# Altium schematic sheet betaV1.1.SchDoc
size A2
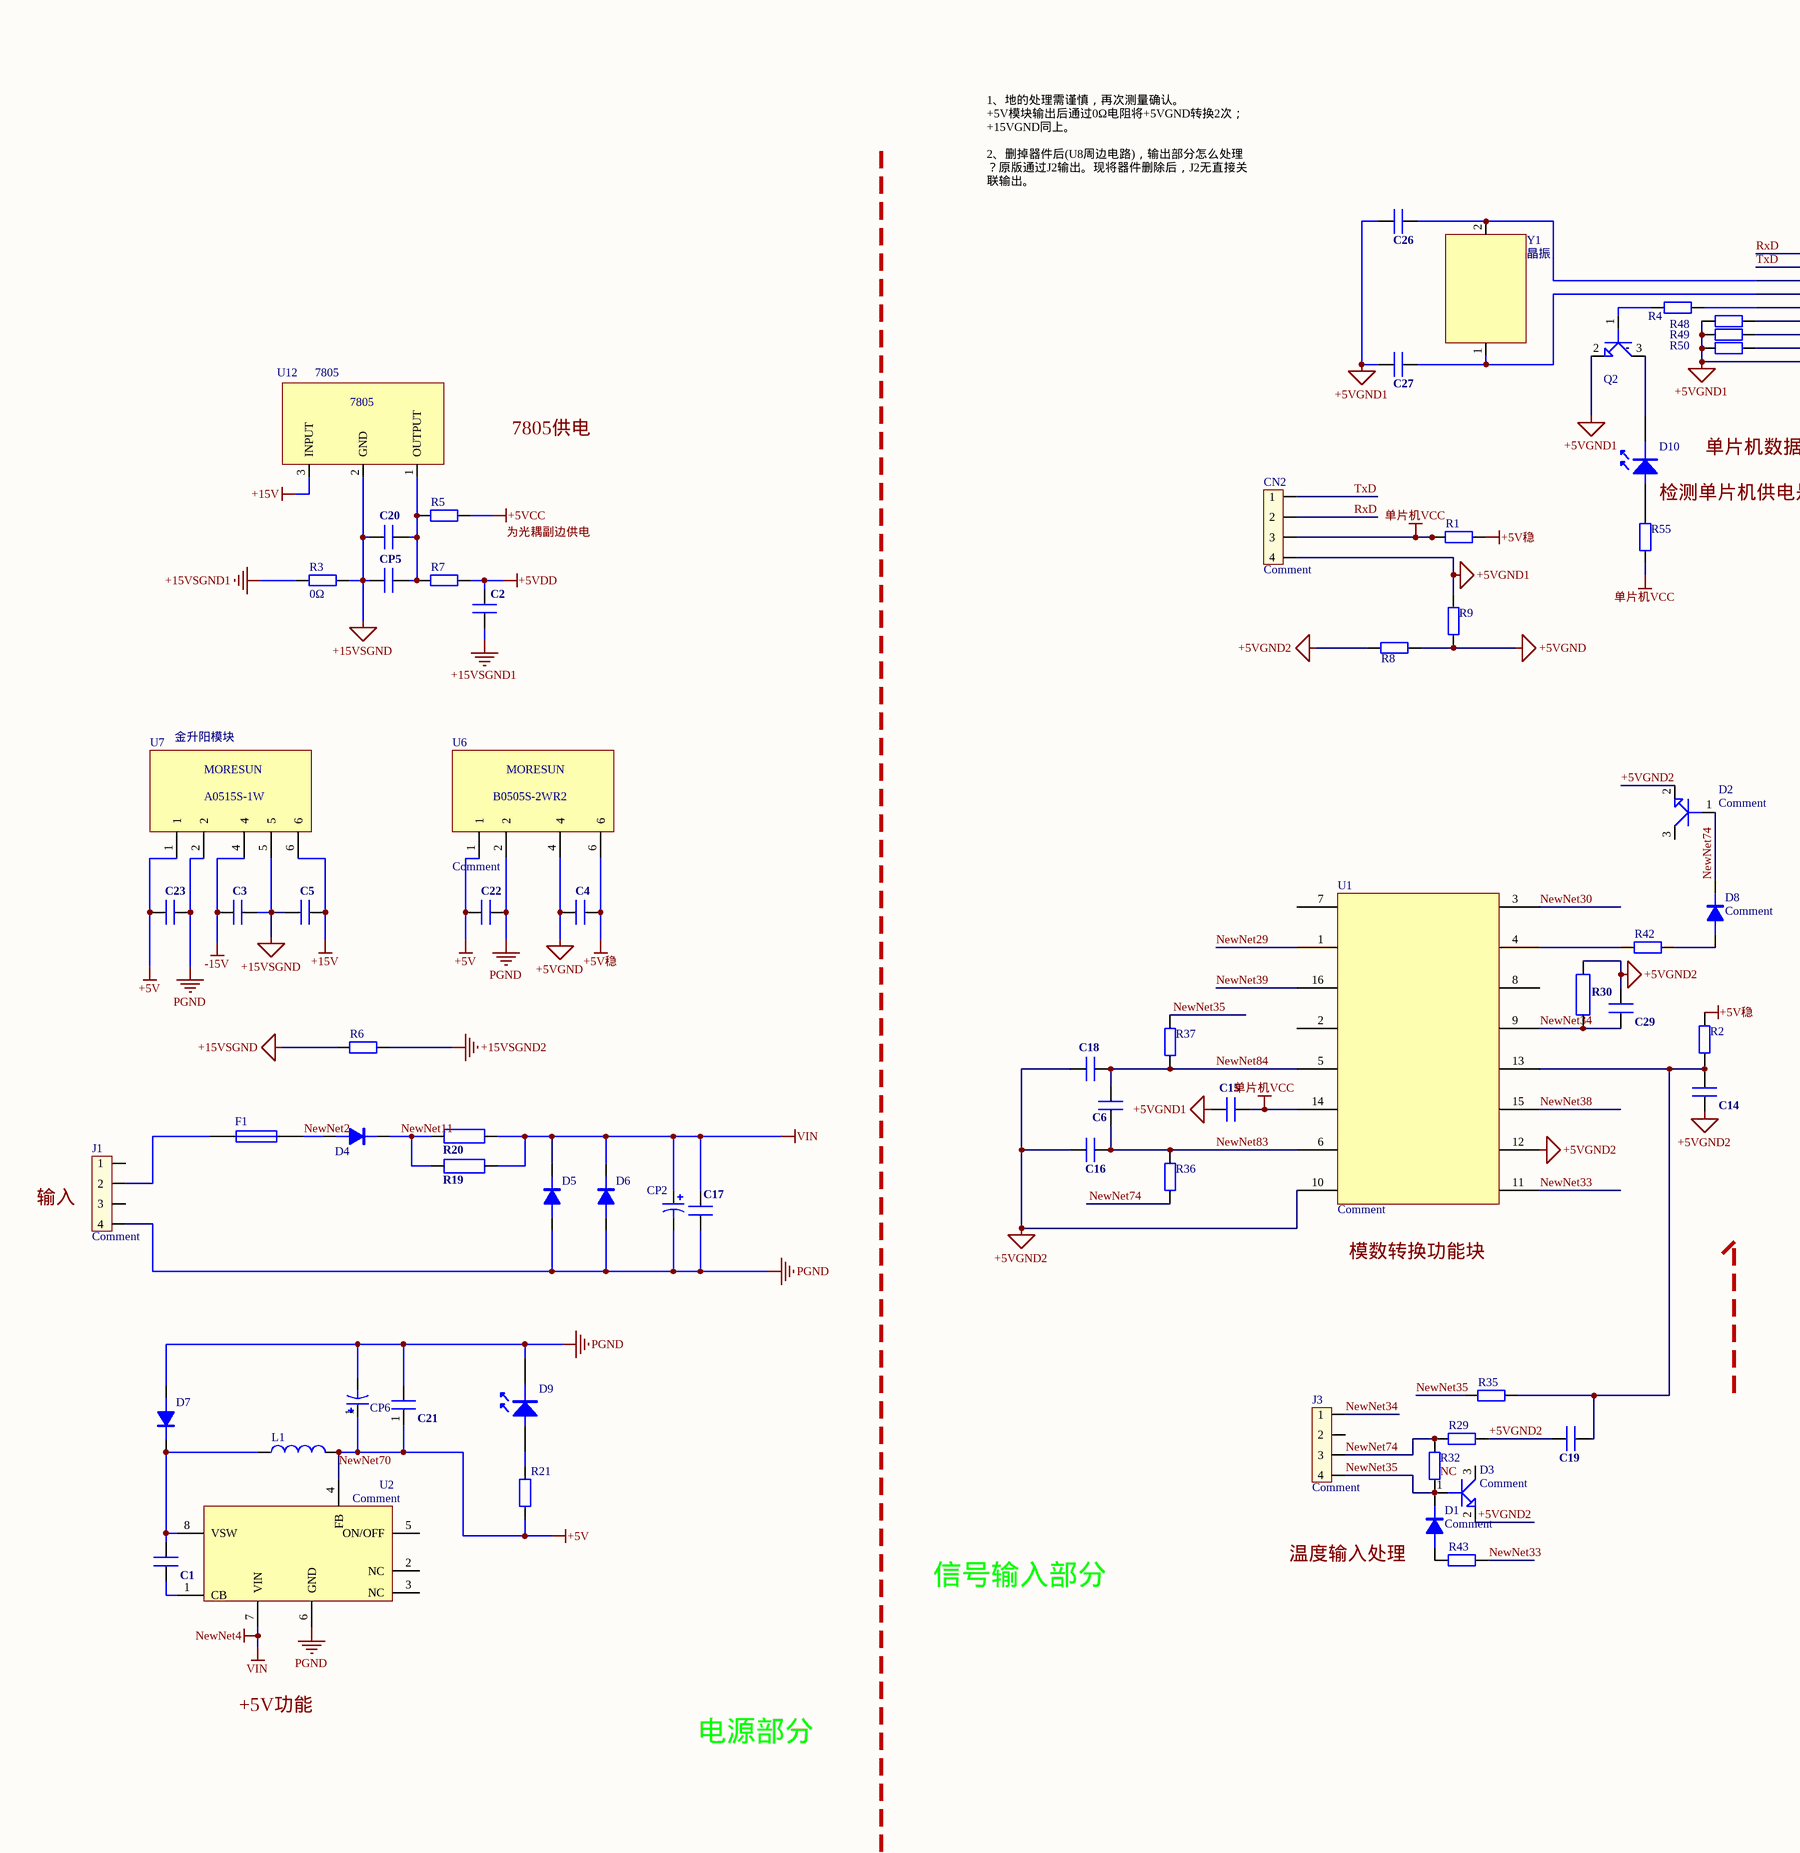
[diagram p0: betaV1.1.SchDoc, left]
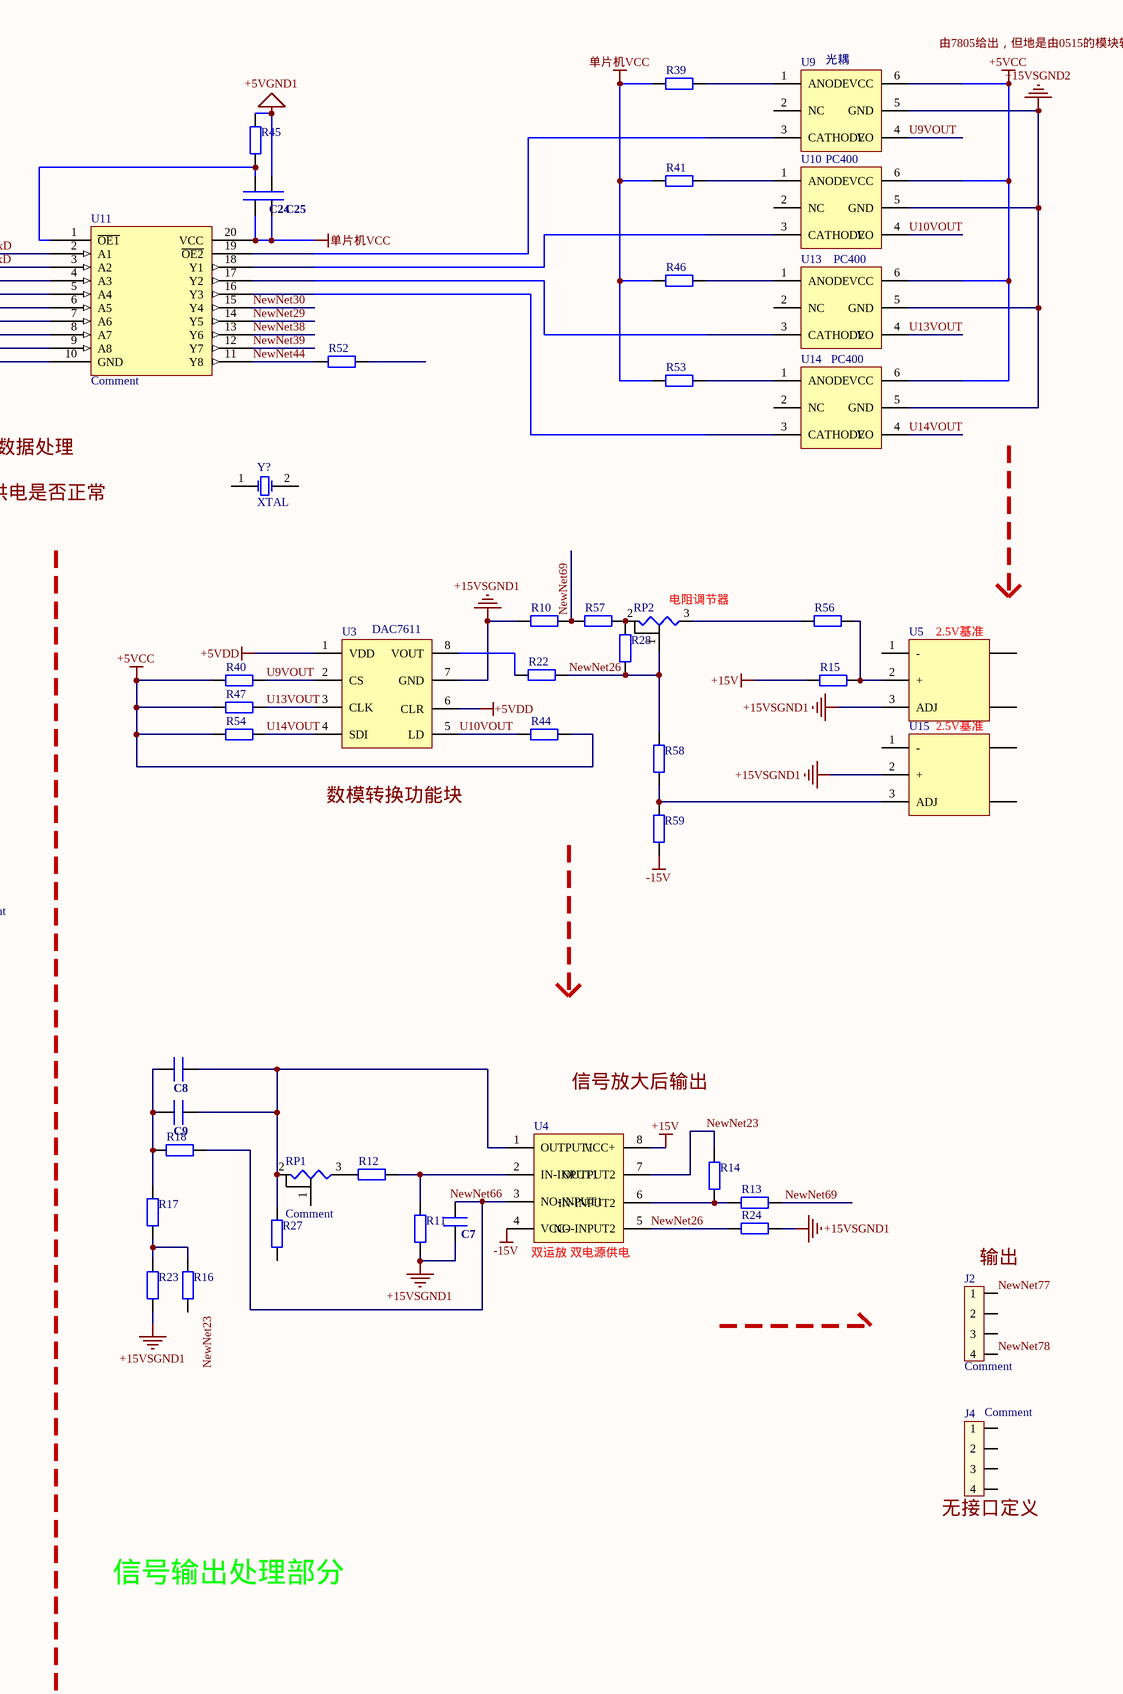
[diagram p1: betaV1.1.SchDoc, right]

## Parts
C1  Comment  [C0805]  (value not drawn)
C2  Comment  [C0805]  (value not drawn)
C3  Comment  [C0805]  (value not drawn)
C4  Comment  [C0805]  (value not drawn)
C5  Comment  [C0805]  (value not drawn)
C6  Comment  [C0805]  (value not drawn)
C7  Comment  [C0805]  (value not drawn)
C8  Comment  [C0805]  (value not drawn)
C9  Comment  [C0805]  (value not drawn)
C14  Comment  [C0805]  (value not drawn)
C15  Comment  [C0805]  (value not drawn)
C16  Comment  [C0805]  (value not drawn)
C17  Comment  [C0805]  (value not drawn)
C18  Comment  [C0805]  (value not drawn)
C19  Comment  [C0805]  (value not drawn)
C20  Comment  [C0805]  (value not drawn)
C21  Comment  [C0805]  (value not drawn)
C22  Comment  [C0805]  (value not drawn)
C23  Comment  [C0805]  (value not drawn)
C24  Comment  [C0805]  (value not drawn)
C25  Comment  [C0805]  (value not drawn)
C26  Comment  [C0805]  (value not drawn)
C27  Comment  [C0805]  (value not drawn)
C29  Comment  [C0805]  (value not drawn)
CN2  Comment  [HDR2.54-LI-4P]
CP2  Comment  [CAP 3.5*8*11.5]  (value not drawn)
CP5  Comment  [CD B(3528)]  (value not drawn)
CP6  Comment  [CAP 3.5*8*11.5]  (value not drawn)
D1  Comment  [SOD-123]
D2  Comment  [SOT-23]
D3  Comment  [SOT-23]
D4  Comment  [SS14]  (value not drawn)
D5  Comment  [SMB]  (value not drawn)
D6  Comment  [SMB]  (value not drawn)
D7  (no value)  [SS14]
D8  Comment  [SOD-123]
D9  (no value)  [LED 3MM-R]
D10  (no value)  [LED 3MM-R]
F1  Comment  [FU 1812]  (value not drawn)
J1  Comment  [电源输入/出]
J2  Comment  [电源输入/出]
J3  Comment  [电源输入/出]
J4  Comment  [电源输入/出]
L1  Comment  [PK0810]  (value not drawn)
Q2  Comment  [SOT-23]  (value not drawn)
R1  Comment  [R0805]  (value not drawn)
R2  Comment  [R0805]  (value not drawn)
R3  value 0Ω  [R0805]  (hidden comment: Comment)
R4  Comment  [R0805]  (value not drawn)
R5  Comment  [R0805]  (value not drawn)
R6  Comment  [R0805]  (value not drawn)
R7  Comment  [R0805]  (value not drawn)
R8  Comment  [R0805]  (value not drawn)
R9  Comment  [R0805]  (value not drawn)
R10  Comment  [R0805]  (value not drawn)
R11  Comment  [R0805]  (value not drawn)
R12  Comment  [R0805]  (value not drawn)
R13  Comment  [R0805]  (value not drawn)
R14  Comment  [R0805]  (value not drawn)
R15  Comment  [R0805]  (value not drawn)
R16  Comment  [R0805]  (value not drawn)
R17  Comment  [R0805]  (value not drawn)
R18  Comment  [R0805]  (value not drawn)
R19  Comment  [金属膜电阻-RS 1/2W-V4]  (value not drawn)
R20  Comment  [金属膜电阻-RS 1/2W-V4]  (value not drawn)
R21  Comment  [R0805]  (value not drawn)
R22  Comment  [R0805]  (value not drawn)
R23  Comment  [R0805]  (value not drawn)
R24  Comment  [R0805]  (value not drawn)
R27  Comment  [R0805]  (value not drawn)
R28  Comment  [R0805]  (value not drawn)
R29  Comment  [R0805]  (value not drawn)
R30  Comment  [金属膜电阻-RS 1/2W-V4]  (value not drawn)
R32  value NC  [R0805]  (hidden comment: Comment)
R35  Comment  [R0805]  (value not drawn)
R36  Comment  [R0805]  (value not drawn)
R37  Comment  [R0805]  (value not drawn)
R39  Comment  [R0805]  (value not drawn)
R40  Comment  [R0805]  (value not drawn)
R41  Comment  [R0805]  (value not drawn)
R42  10k  [R0805]  (value not drawn)
R43  Comment  [R0805]  (value not drawn)
R44  Comment  [R0805]  (value not drawn)
R45  Comment  [R0805]  (value not drawn)
R46  Comment  [R0805]  (value not drawn)
R47  Comment  [R0805]  (value not drawn)
R48  Comment  [R0805]  (value not drawn)
R49  Comment  [R0805]  (value not drawn)
R50  Comment  [R0805]  (value not drawn)
R52  Comment  [R0805]  (value not drawn)
R53  Comment  [R0805]  (value not drawn)
R54  Comment  [R0805]  (value not drawn)
R55  Comment  [R0805]  (value not drawn)
R56  Comment  [R0805]  (value not drawn)
R57  Comment  [R0805]  (value not drawn)
R58  Comment  [R0805]  (value not drawn)
R59  Comment  [R0805]  (value not drawn)
RP1  Comment  [可调电阻]
RP2  电阻调节器  [可调电阻]
U1  Comment  [TSSOP16]
U2  Comment  [SO-8]
U3  DAC7611  [SO-8]
U4  双运放 双电源供电  [SO-8]
U5  value 2.5V基准  [LM336]
U6  Comment  [B0505S-2WR2]
U7  金升阳模块  [B0505S-2WR2]
U9  光耦  [PC400]
U10  PC400  [PC400]
U11  Comment  [12C5616AD-SOP20]
U12  7805
U13  PC400  [PC400]
U14  PC400  [PC400]
U15  value 2.5V基准  [LM336]
Y1  晶振  [晶振]
Y?  XTAL  [R38]

## Nets
+5VCC: R5.2 R40.2 R44.2 R47.2 R54.2 U9.6(VCC) U10.6(VCC) U13.6(VCC) U14.6(VCC)
+5VDD: C2.1 R7.1 U3.1(VDD) U3.6(CLR)
+5VGND: C4.2 R8.1 R9.1 U6.4
+5VGND1: C15.1 C25.2 C26.2 C27.1 CN2.4 Q2.2(E) R9.2 R45.2 R48.2 R49.2 R50.2 U11.10(GND)
+5VGND2: C14.1 C16.2 C18.1 C19.2 C29.2 D2.2(E) D3.2(E) R8.2 R29.1 R30.2 U1.10(PGND) U1.12(SS)
+5V稳: C4.1 R1.1 R2.2 U6.6
+15V: C5.1 R15.1 U4.8(VCC+) U7.6 U12.3(INPUT)
+15VSGND: C3.1 C5.2 C20.1 CP5.1 R3.2 R6.2 U7.5 U12.2(GND)
+15VSGND1: C2.2 C7.1 R3.1 R10.1 R11.1 R23.1 R24.2 U3.7(GND) U5.3(ADJ) U15.2(+)
+15VSGND2: R6.1 U9.5(GND) U10.5(GND) U13.5(GND) U14.5(GND)
-15V: C3.2 R59.2 U4.4(VCC-) U7.4
NewNet4: C17.1 CP2.1 D5.2(K) D6.2(K) R19.2 R20.2 U2.7(VIN)  [also labelled VIN]
NewNet70: C21.1 C22.2 C23.2 CP6.1 L1.2 R21.2 U2.4(FB) U6.1 U7.1  [also labelled +5V]
PGND: C17.2 C21.2 C22.1 C23.1 CP2.2 CP6.2 D5.1(A) D6.1(A) D7.2(K) D9.2 J1.4 U2.6(GND) U6.2 U7.2
单片机VCC: C15.2 C24.2 C25.1 CN2.3 R1.2 R39.1 R41.1 R46.1 R53.1 R55.1 U1.14(RT) U11.20(VCC)
NewNet2: D4.1(A) F1.2
NewNet11: D4.2(K) R19.1 R20.1
NewNet23: R14.1 U4.7(OUTPUT2)
NewNet26: R22.1 R24.1 R28.2 R58.2 RP2.1 U4.5(NO-INPUT2)
NewNet29: U1.1(VIN) U11.14(Y5)
NewNet30: U1.3(CS1) U11.15(Y4)
NewNet33: R43.1 U1.11(ANGD)
NewNet34: C29.1 J3.1 R30.1 U1.9(OUTB)
NewNet35: D1.2(K) D3.1(B) J3.4 R32.2 R35.1 R37.2
NewNet38: U1.15(SYNC) U11.13(Y6)
NewNet39: U1.16(UVLO) U11.12(Y7)
NewNet44: R52.2 U11.11(Y8)
NewNet69: R10.2 R13.2 R57.2
NewNet74: D2.1(B) D8.2(K) J3.3 R29.2 R32.1 R36.2
NewNet77: J2.1
NewNet78: J2.4
NewNet83: C6.2 C16.1 R36.1 U1.6(REF)
NewNet84: C6.1 C18.2 R37.1 U1.5(TIME)
RxD: CN2.2 U11.2(A1)
TxD: CN2.1 U11.3(A2)
U9VOUT: R40.1 U3.2(CS) U9.4(VO)
U10VOUT: R44.1 U3.5(LD) U10.4(VO)
U13VOUT: R47.1 U3.3(CLK) U13.4(VO)
U14VOUT: R54.1 U3.4(SDI) U14.4(VO)
NetC1_1: C1.1 U2.1(CB)
NetC1_2: C1.2 D7.1(A) L1.1 U2.8(VSW)
NetC7_2: C7.2 R18.2 U4.3(NO-INPUT1)
NetC8_1: C8.1 C9.1 R17.2 R18.1
NetC8_2: C8.2 C9.2 R27.1 RP1.2 U4.1(OUTPUT1)
NetC14_2: C14.2 C19.1 R2.1 R35.2 U1.13(COMP)
NetC20_2: C20.2 CP5.2 R5.1 R7.2 U12.1(OUTPUT)
NetC24_1: C24.1 R45.1 U11.1(~{OE1})
NetC26_1: C26.1 U11.4(A3) Y1.2(GND)
NetC27_2: C27.2 U11.5(A4) Y1.1(CONTRL)
NetD1_1: D1.1(A) R43.2
NetD8_1: D8.1(A) R42.2
NetD9_1: D9.1 R21.1
NetD10_1: D10.1 R55.2
NetD10_2: D10.2 Q2.3(C)
NetF1_1: F1.1 J1.2
NetQ2_1: Q2.1(B) R4.2
NetR4_1: R4.1 U11.6(A5)
NetR11_2: R11.2 R12.2 U4.2(IN-INPUT1)
NetR12_1: R12.1 RP1.3
NetR13_1: R13.1 R14.2 U4.6(IN-INPUT2)
NetR15_2: R15.2 R56.1 U5.2(+)
NetR16_2: R16.2 R17.1 R23.2
NetR22_2: R22.2 U3.8(VOUT)
NetR28_1: R28.1 R57.1 RP2.2
NetR39_2: R39.2 U9.1(ANODE)
NetR41_2: R41.2 U10.1(ANODE)
NetR42_1: R42.1 U1.4(CS2)
NetR46_2: R46.2 U13.1(ANODE)
NetR48_1: R48.1 U11.7(A6)
NetR49_1: R49.1 U11.8(A7)
NetR50_1: R50.1 U11.9(A8)
NetR53_2: R53.2 U14.1(ANODE)
NetR56_2: R56.2 RP2.3
NetR58_1: R58.1 R59.1 U15.3(ADJ)
NetU9_3: U9.3(CATHODE) U11.19(~{OE2})
NetU10_3: U10.3(CATHODE) U11.18(Y1)
NetU11_16: U11.16(Y3) U14.3(CATHODE)
NetU11_17: U11.17(Y2) U13.3(CATHODE)

Not connected (* = marked no-connect by the designer): D2 3(C); D3 3(C); J1 1 3; J2 2 3; J3 2; J4 1 2 3 4; R16 1; R27 2; R52 1; RP1 1; U1 2(RAMP) 7(VCC) 8(OUTA); U2 2(NC) 3(NC) 5(ON/OFF); U5 1(-) 4 5; U9 2(NC); U10 2(NC); U13 2(NC); U14 2(NC); U15 1(-) 4 5; Y? 1(OSC1) 2(OSC2)

## Notes on the sheet
- 由7805给出，但地是由0515的模块转出？
- 1、地的处理需谨慎，再次测量确认。
  +5V模块输出后通过0Ω电阻将+5VGND转换2次；+15VGND同上。
  2、删掉器件后(U8周边电路)，输出部分怎么处理？原版通过J2输出。现将器件删除后，J2无直接关联输出。
- 7805供电
- 检测单片机供电是否正常
- 单片机数据处理
- 为光耦副边供电
- (near U3) 数模转换功能块
- 信号放大后输出
- 输入
- (near U1) 模数转换功能块
- (near J2) 输出
- (near J4) 无接口定义
- 信号输入部分
- 温度输入处理
- 信号输出处理部分
- +5V功能
- 电源部分
- Labels drawn without touching a wire or pin: NewNet23, NewNet66
- (in symbol A0515S-1W) MORESUN
- (in symbol B0505S2W) MORESUN; B0505S-2WR2

## Library data of the parts
C1 = 04-02-01: VALUE: 50V/103
C2-C9 C14-C16 C18-C20 C22-C27 C29 CP5 = 04-02-01: VALUE: 25V/105
C17 C21 = 04-02-01: VALUE: 50V/104
CN2 J1-J4 = CON4
CP2 CP6 = Cap Pol3: Value: 50V100UF
D1 D5-D8 = DIODE
D2 D3 Q2 = NPN-SOT23
D4 = DIODE: VALUE: 1A/40V
D9 D10 = LED
F1 = Fuse 1: VALUE: 1A/50V
L1 = Inductor: Value: 47uH
R1-R18 R21-R24 R27-R29 R32 R35-R37 R39-R50 R52-R59 = Res: Resistor; Published: 8-Jun-2000; LatestRevisionDate: 17-Jul-2002; LatestRevisionNote: Re-released for DXP Platform.; PackageReference: AXIAL-0.4; Publisher: Altium Limited
R19 R20 R30 = R: VALUE: 1W/10R
RP1 RP2 = RES_1
U1 = LM5025
U2 = LM2756
U3 U4 = SI8420BB
U5 U15 = SN74LVC
U6 = B0505S2W
U7 = A0515S-1W
U9 U10 U13 U14 = MAX5078
U11 = SN74LV5: 八路三态门
Y1 = CVHD‐950‐122.880
Y? = XTAL: Crystal Oscillator; Published: 8-Jun-2000; LatestRevisionDate: 17-Jul-2002; LatestRevisionNote: Re-released for DXP Platform.; PackageReference: R38; Publisher: Altium Limited; PackageDescription: Crystal, Thru-Hole; 2 Leads; Body 3.1 x 8.2 mm (Dia.xH)